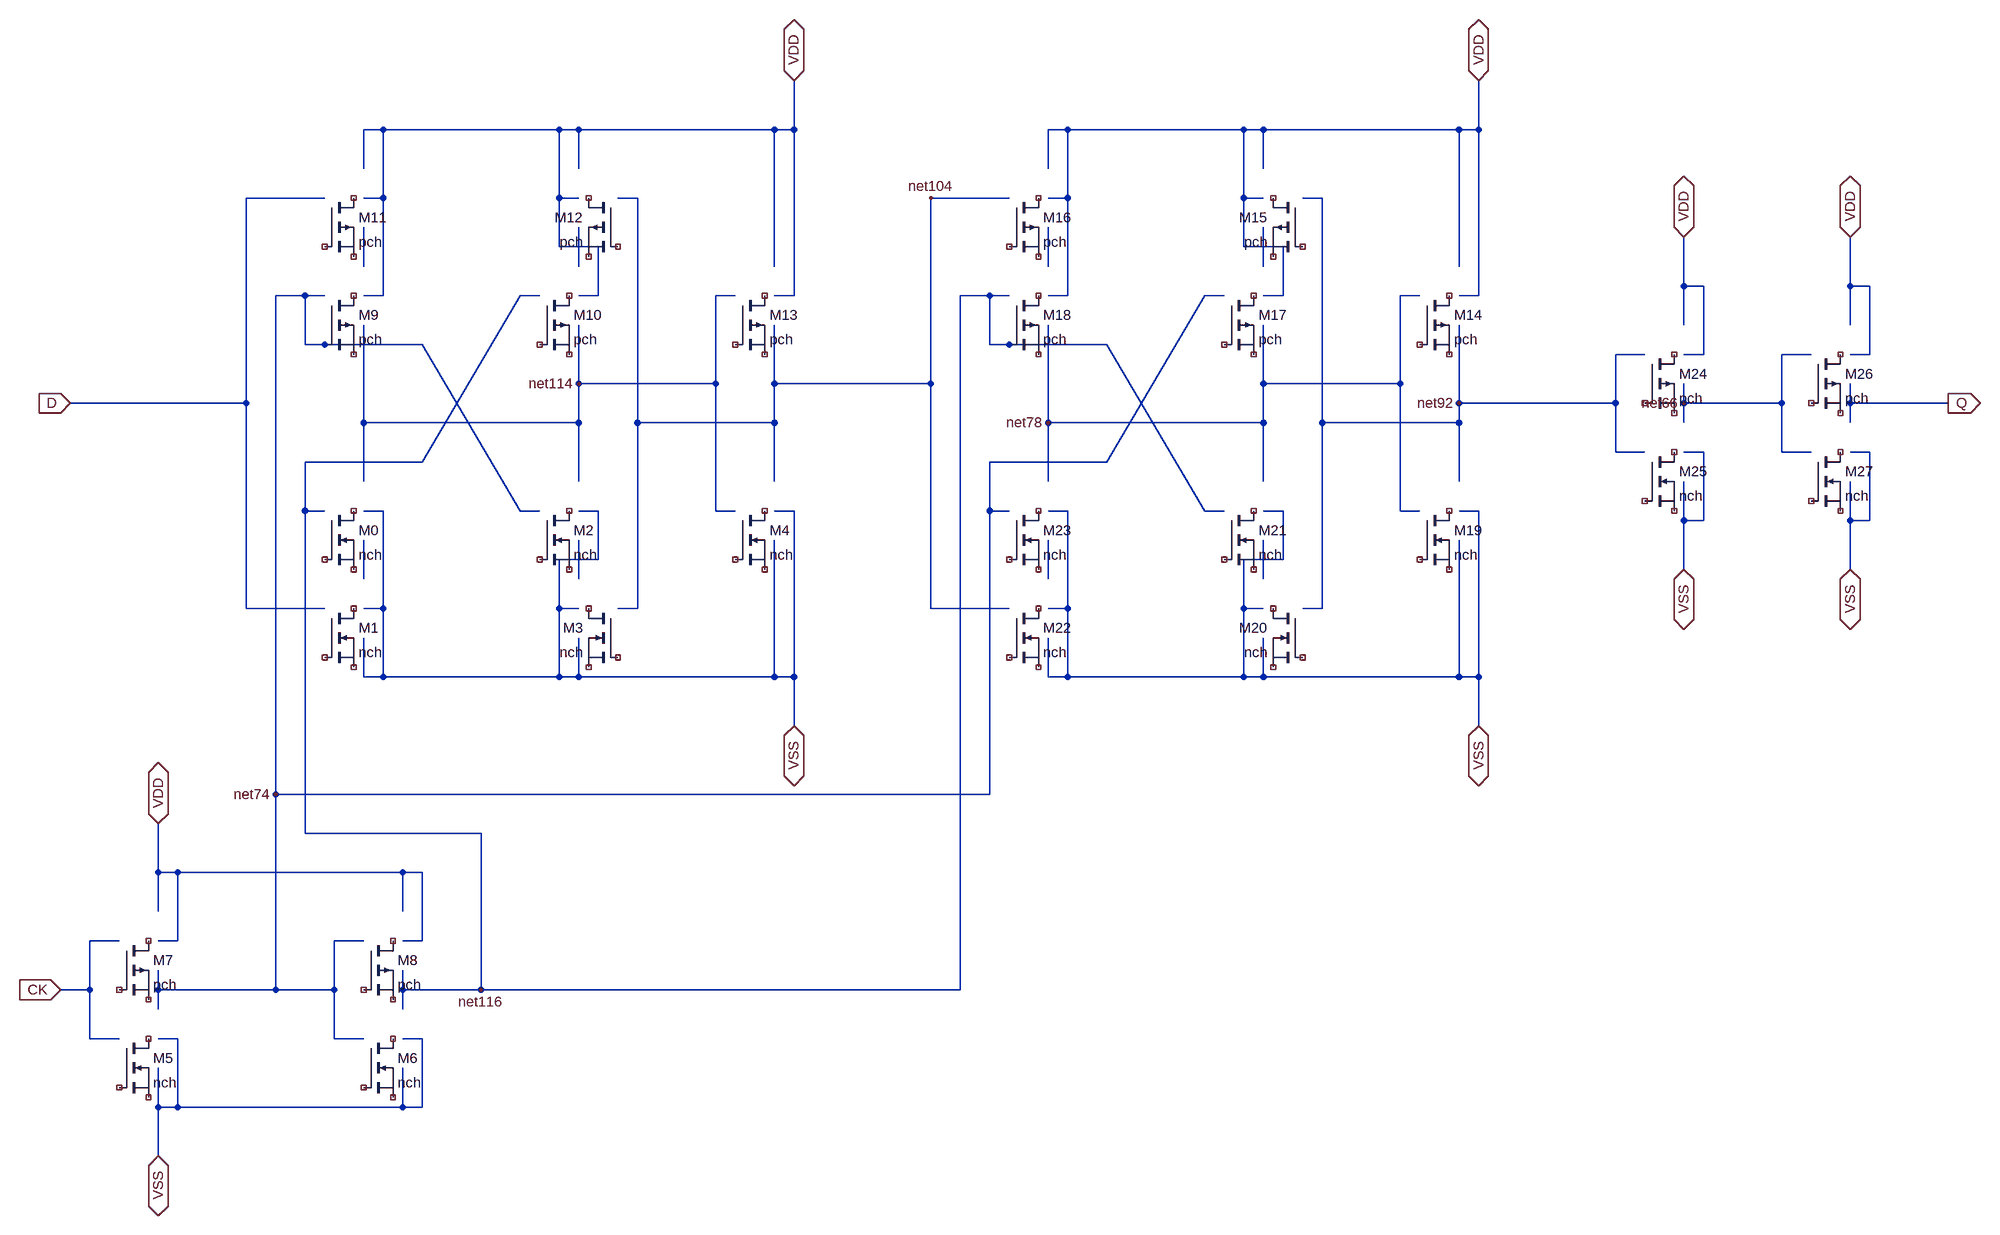
[diagram p0: schematic dff1.asc]
dff1.asc, the LTspice schematic file:
Version 4
SHEET 1 3264 1952
WIRE 944 592 1168 592
WIRE 1168 592 1168 448
WIRE 944 592 944 496
WIRE 1168 800 1200 800
WIRE 1168 800 1168 592
WIRE 1168 448 1200 448
WIRE 592 656 944 656
WIRE 944 656 944 592
WIRE 592 656 592 496
WIRE 944 752 944 656
WIRE 592 752 592 656
WIRE 1712 752 1712 656
WIRE 2064 752 2064 656
WIRE 1712 656 1712 496
WIRE 2064 656 2064 592
WIRE 1712 656 2064 656
WIRE 2288 448 2320 448
WIRE 2288 800 2288 592
WIRE 2288 800 2320 800
WIRE 2064 592 2064 496
WIRE 2288 592 2288 448
WIRE 2064 592 2288 592
WIRE 448 1264 1616 1264
WIRE 1616 800 1648 800
WIRE 1616 800 1616 720
WIRE 1616 720 1808 720
WIRE 1968 448 2000 448
WIRE 1808 720 1968 448
WIRE 448 1584 544 1584
WIRE 448 1584 448 1264
WIRE 1616 1264 1616 800
WIRE 688 528 848 800
WIRE 256 1584 448 1584
WIRE 544 1584 544 1504
WIRE 448 448 496 448
WIRE 544 1664 544 1584
WIRE 256 1616 256 1584
WIRE 544 1504 592 1504
WIRE 544 1664 592 1664
WIRE 256 1584 256 1552
WIRE 448 1264 448 448
WIRE 848 800 880 800
WIRE 496 528 688 528
WIRE 496 528 496 448
WIRE 496 448 528 448
WIRE 784 1584 1568 1584
WIRE 1568 448 1616 448
WIRE 1616 448 1648 448
WIRE 1616 528 1616 448
WIRE 1616 528 1808 528
WIRE 1968 800 2000 800
WIRE 1808 528 1968 800
WIRE 1568 1584 1568 448
WIRE 656 1584 656 1552
WIRE 496 1328 784 1328
WIRE 656 1584 784 1584
WIRE 784 1584 784 1328
WIRE 496 1328 496 800
WIRE 688 720 848 448
WIRE 656 1616 656 1584
WIRE 848 448 880 448
WIRE 496 720 688 720
WIRE 496 800 496 720
WIRE 496 800 528 800
WIRE 1712 400 1712 336
WIRE 96 1584 144 1584
WIRE 144 1584 144 1504
WIRE 144 1664 192 1664
WIRE 144 1664 144 1584
WIRE 144 1504 192 1504
WIRE 592 400 592 336
WIRE 2064 912 2064 848
WIRE 1712 912 1712 848
WIRE 1520 288 1648 288
WIRE 1264 592 1520 592
WIRE 1520 960 1520 592
WIRE 1264 656 1264 592
WIRE 1264 592 1264 496
WIRE 1520 960 1648 960
WIRE 1040 656 1264 656
WIRE 1520 592 1520 288
WIRE 1040 656 1040 288
WIRE 1008 960 1040 960
WIRE 1040 960 1040 656
WIRE 1008 288 1040 288
WIRE 1264 752 1264 656
WIRE 944 400 944 336
WIRE 592 912 592 848
WIRE 2384 624 2640 624
WIRE 2640 624 2640 544
WIRE 2384 624 2384 496
WIRE 2640 704 2640 624
WIRE 2640 704 2688 704
WIRE 2640 544 2688 544
WIRE 2128 288 2160 288
WIRE 2128 960 2160 960
WIRE 2160 656 2160 288
WIRE 2160 960 2160 656
WIRE 2384 656 2384 624
WIRE 2384 752 2384 656
WIRE 2160 656 2384 656
WIRE 2752 624 2912 624
WIRE 2912 624 2912 544
WIRE 2752 624 2752 592
WIRE 2912 704 2912 624
WIRE 2912 704 2960 704
WIRE 2912 544 2960 544
WIRE 2752 656 2752 624
WIRE 112 624 400 624
WIRE 400 624 400 288
WIRE 400 960 528 960
WIRE 400 960 400 624
WIRE 400 288 528 288
WIRE 3024 624 3184 624
WIRE 3024 624 3024 592
WIRE 3024 656 3024 624
WIRE 3056 544 3056 432
WIRE 3024 432 3056 432
WIRE 3024 544 3056 544
WIRE 3024 496 3024 432
WIRE 3024 432 3024 352
WIRE 2784 544 2784 432
WIRE 2752 432 2784 432
WIRE 2752 544 2784 544
WIRE 2752 496 2752 432
WIRE 2752 432 2752 352
WIRE 1712 240 1712 176
WIRE 1712 176 1744 176
WIRE 2064 240 2064 176
WIRE 2064 448 2096 448
WIRE 2096 448 2096 368
WIRE 2032 368 2096 368
WIRE 2032 176 2064 176
WIRE 2032 368 2032 288
WIRE 2032 288 2032 176
WIRE 2032 288 2064 288
WIRE 1712 448 1744 448
WIRE 1744 176 2032 176
WIRE 1744 448 1744 288
WIRE 1744 288 1744 176
WIRE 1712 288 1744 288
WIRE 2064 176 2384 176
WIRE 2384 400 2384 176
WIRE 2384 448 2416 448
WIRE 2416 448 2416 176
WIRE 2384 176 2416 176
WIRE 2416 176 2416 96
WIRE 256 1392 256 1312
WIRE 656 1392 688 1392
WIRE 688 1504 688 1392
WIRE 656 1504 688 1504
WIRE 288 1504 288 1392
WIRE 256 1504 288 1504
WIRE 656 1456 656 1392
WIRE 256 1456 256 1392
WIRE 256 1392 288 1392
WIRE 1296 176 1296 96
WIRE 1264 176 1296 176
WIRE 1296 448 1296 176
WIRE 1264 448 1296 448
WIRE 1264 400 1264 176
WIRE 944 176 1264 176
WIRE 592 288 624 288
WIRE 624 288 624 176
WIRE 624 448 624 288
WIRE 624 176 912 176
WIRE 592 448 624 448
WIRE 912 288 944 288
WIRE 912 288 912 176
WIRE 912 368 912 288
WIRE 912 176 944 176
WIRE 912 368 976 368
WIRE 976 448 976 368
WIRE 944 448 976 448
WIRE 944 240 944 176
WIRE 592 176 624 176
WIRE 592 240 592 176
WIRE 288 1392 656 1392
WIRE 944 912 944 848
WIRE 2064 400 2064 336
WIRE 3024 816 3024 896
WIRE 3056 816 3056 704
WIRE 3024 816 3056 816
WIRE 3024 704 3056 704
WIRE 3024 752 3024 816
WIRE 2752 816 2752 896
WIRE 2784 816 2784 704
WIRE 2752 816 2784 816
WIRE 2752 704 2784 704
WIRE 2752 752 2752 816
WIRE 1712 1072 1712 1008
WIRE 1712 1072 1744 1072
WIRE 2064 1072 2064 1008
WIRE 1712 800 1744 800
WIRE 1744 1072 2032 1072
WIRE 1744 1072 1744 960
WIRE 1744 960 1744 800
WIRE 1712 960 1744 960
WIRE 2064 800 2096 800
WIRE 2096 880 2096 800
WIRE 2032 880 2096 880
WIRE 2032 1072 2064 1072
WIRE 2032 1072 2032 960
WIRE 2032 960 2032 880
WIRE 2032 960 2064 960
WIRE 2064 1072 2384 1072
WIRE 2384 1072 2384 848
WIRE 2384 800 2416 800
WIRE 2416 1072 2416 800
WIRE 2384 1072 2416 1072
WIRE 2416 1072 2416 1152
WIRE 256 1776 256 1856
WIRE 656 1776 688 1776
WIRE 688 1776 688 1664
WIRE 656 1664 688 1664
WIRE 288 1776 288 1664
WIRE 256 1664 288 1664
WIRE 256 1712 256 1776
WIRE 256 1776 288 1776
WIRE 656 1712 656 1776
WIRE 1296 1072 1296 1152
WIRE 1264 1072 1296 1072
WIRE 1296 1072 1296 800
WIRE 1264 800 1296 800
WIRE 1264 1072 1264 848
WIRE 944 1072 1264 1072
WIRE 912 960 944 960
WIRE 912 960 912 880
WIRE 912 1072 912 960
WIRE 912 1072 944 1072
WIRE 912 880 976 880
WIRE 976 880 976 800
WIRE 944 800 976 800
WIRE 592 960 624 960
WIRE 624 960 624 800
WIRE 624 1072 624 960
WIRE 624 1072 912 1072
WIRE 592 800 624 800
WIRE 944 1072 944 1008
WIRE 592 1072 624 1072
WIRE 592 1072 592 1008
WIRE 288 1776 656 1776
FLAG 944 592 net114
FLAG 1712 656 net78
FLAG 448 1264 net74
FLAG 784 1584 net116
FLAG 1520 288 net104
FLAG 2384 624 net92
FLAG 2752 624 net66
SYMBOL PMOS 2960 544 R0
SYMATTR InstName M26
SYMATTR Value pch
SYMATTR Value2 w=6u l=1u
SYMBOL PMOS 2688 544 R0
SYMATTR InstName M24
SYMATTR Value pch
SYMATTR Value2 w=6u l=1u
SYMBOL PMOS 1648 448 R0
SYMATTR InstName M18
SYMATTR Value pch
SYMATTR Value2 w=6u l=1u
SYMBOL PMOS 2000 448 R0
SYMATTR InstName M17
SYMATTR Value pch
SYMATTR Value2 w=6u l=1u
SYMBOL PMOS 1648 288 R0
SYMATTR InstName M16
SYMATTR Value pch
SYMATTR Value2 w=6u l=1u
SYMBOL PMOS 2128 288 M0
SYMATTR InstName M15
SYMATTR Value pch
SYMATTR Value2 w=6u l=1u
SYMBOL PMOS 2320 448 R0
SYMATTR InstName M14
SYMATTR Value pch
SYMATTR Value2 w=6u l=1u
SYMBOL PMOS 1200 448 R0
SYMATTR InstName M13
SYMATTR Value pch
SYMATTR Value2 w=6u l=1u
SYMBOL PMOS 1008 288 M0
SYMATTR InstName M12
SYMATTR Value pch
SYMATTR Value2 w=6u l=1u
SYMBOL PMOS 528 288 R0
SYMATTR InstName M11
SYMATTR Value pch
SYMATTR Value2 w=6u l=1u
SYMBOL PMOS 880 448 R0
SYMATTR InstName M10
SYMATTR Value pch
SYMATTR Value2 w=6u l=1u
SYMBOL PMOS 528 448 R0
SYMATTR InstName M9
SYMATTR Value pch
SYMATTR Value2 w=6u l=1u
SYMBOL PMOS 592 1504 R0
SYMATTR InstName M8
SYMATTR Value pch
SYMATTR Value2 w=6u l=1u
SYMBOL PMOS 192 1504 R0
SYMATTR InstName M7
SYMATTR Value pch
SYMATTR Value2 w=6u l=1u
SYMBOL NMOS 2960 704 R0
SYMATTR InstName M27
SYMATTR Value nch
SYMATTR Value2 w=2u l=1u
SYMBOL NMOS 2688 704 R0
SYMATTR InstName M25
SYMATTR Value nch
SYMATTR Value2 w=2u l=1u
SYMBOL NMOS 1648 800 R0
SYMATTR InstName M23
SYMATTR Value nch
SYMATTR Value2 w=2u l=1u
SYMBOL NMOS 1648 960 R0
SYMATTR InstName M22
SYMATTR Value nch
SYMATTR Value2 w=2u l=1u
SYMBOL NMOS 2000 800 R0
SYMATTR InstName M21
SYMATTR Value nch
SYMATTR Value2 w=2u l=1u
SYMBOL NMOS 2128 960 M0
SYMATTR InstName M20
SYMATTR Value nch
SYMATTR Value2 w=2u l=1u
SYMBOL NMOS 2320 800 R0
SYMATTR InstName M19
SYMATTR Value nch
SYMATTR Value2 w=2u l=1u
SYMBOL NMOS 592 1664 R0
SYMATTR InstName M6
SYMATTR Value nch
SYMATTR Value2 w=2u l=1u
SYMBOL NMOS 192 1664 R0
SYMATTR InstName M5
SYMATTR Value nch
SYMATTR Value2 w=2u l=1u
SYMBOL NMOS 1200 800 R0
SYMATTR InstName M4
SYMATTR Value nch
SYMATTR Value2 w=2u l=1u
SYMBOL NMOS 1008 960 M0
SYMATTR InstName M3
SYMATTR Value nch
SYMATTR Value2 w=2u l=1u
SYMBOL NMOS 880 800 R0
SYMATTR InstName M2
SYMATTR Value nch
SYMATTR Value2 w=2u l=1u
SYMBOL NMOS 528 960 R0
SYMATTR InstName M1
SYMATTR Value nch
SYMATTR Value2 w=2u l=1u
SYMBOL NMOS 528 800 R0
SYMATTR InstName M0
SYMATTR Value nch
SYMATTR Value2 w=2u l=1u
FLAG 3184 624 Q
IOPIN 3184 624 Out
FLAG 3024 352 VDD
IOPIN 3024 352 BiDir
FLAG 3024 896 VSS
IOPIN 3024 896 BiDir
FLAG 2752 352 VDD
IOPIN 2752 352 BiDir
FLAG 2752 896 VSS
IOPIN 2752 896 BiDir
FLAG 2416 1152 VSS
IOPIN 2416 1152 BiDir
FLAG 2416 96 VDD
IOPIN 2416 96 BiDir
FLAG 256 1312 VDD
IOPIN 256 1312 BiDir
FLAG 256 1856 VSS
IOPIN 256 1856 BiDir
FLAG 1296 1152 VSS
IOPIN 1296 1152 BiDir
FLAG 1296 96 VDD
IOPIN 1296 96 BiDir
FLAG 112 624 D
IOPIN 112 624 In
FLAG 96 1584 CK
IOPIN 96 1584 In

The netlist it stands for:
* dff1.asc
* M26: pch w=6u l=1u (symbol PMOS not certain, pin order unknown); nets seen at it: 
* M24: pch w=6u l=1u (symbol PMOS not certain, pin order unknown); nets seen at it: 
* M18: pch w=6u l=1u (symbol PMOS not certain, pin order unknown); nets seen at it: net116
* M17: pch w=6u l=1u (symbol PMOS not certain, pin order unknown); nets seen at it: 
* M16: pch w=6u l=1u (symbol PMOS not certain, pin order unknown); nets seen at it: 
* M15: pch w=6u l=1u (symbol PMOS not certain, pin order unknown); nets seen at it: 
* M14: pch w=6u l=1u (symbol PMOS not certain, pin order unknown); nets seen at it: 
* M13: pch w=6u l=1u (symbol PMOS not certain, pin order unknown); nets seen at it: 
* M12: pch w=6u l=1u (symbol PMOS not certain, pin order unknown); nets seen at it: 
* M11: pch w=6u l=1u (symbol PMOS not certain, pin order unknown); nets seen at it: 
* M10: pch w=6u l=1u (symbol PMOS not certain, pin order unknown); nets seen at it: 
* M9: pch w=6u l=1u (symbol PMOS not certain, pin order unknown); nets seen at it: net74
* M8: pch w=6u l=1u (symbol PMOS not certain, pin order unknown); nets seen at it: 
* M7: pch w=6u l=1u (symbol PMOS not certain, pin order unknown); nets seen at it: 
* M27: nch w=2u l=1u (symbol NMOS not certain, pin order unknown); nets seen at it: 
* M25: nch w=2u l=1u (symbol NMOS not certain, pin order unknown); nets seen at it: 
* M23: nch w=2u l=1u (symbol NMOS not certain, pin order unknown); nets seen at it: 
* M22: nch w=2u l=1u (symbol NMOS not certain, pin order unknown); nets seen at it: 
* M21: nch w=2u l=1u (symbol NMOS not certain, pin order unknown); nets seen at it: 
* M20: nch w=2u l=1u (symbol NMOS not certain, pin order unknown); nets seen at it: 
* M19: nch w=2u l=1u (symbol NMOS not certain, pin order unknown); nets seen at it: 
* M6: nch w=2u l=1u (symbol NMOS not certain, pin order unknown); nets seen at it: 
* M5: nch w=2u l=1u (symbol NMOS not certain, pin order unknown); nets seen at it: 
* M4: nch w=2u l=1u (symbol NMOS not certain, pin order unknown); nets seen at it: 
* M3: nch w=2u l=1u (symbol NMOS not certain, pin order unknown); nets seen at it: 
* M2: nch w=2u l=1u (symbol NMOS not certain, pin order unknown); nets seen at it: 
* M1: nch w=2u l=1u (symbol NMOS not certain, pin order unknown); nets seen at it: 
* M0: nch w=2u l=1u (symbol NMOS not certain, pin order unknown); nets seen at it: 
.backanno
.end